# Altium schematic sheet 07_EL_CON.SchDoc
size A4
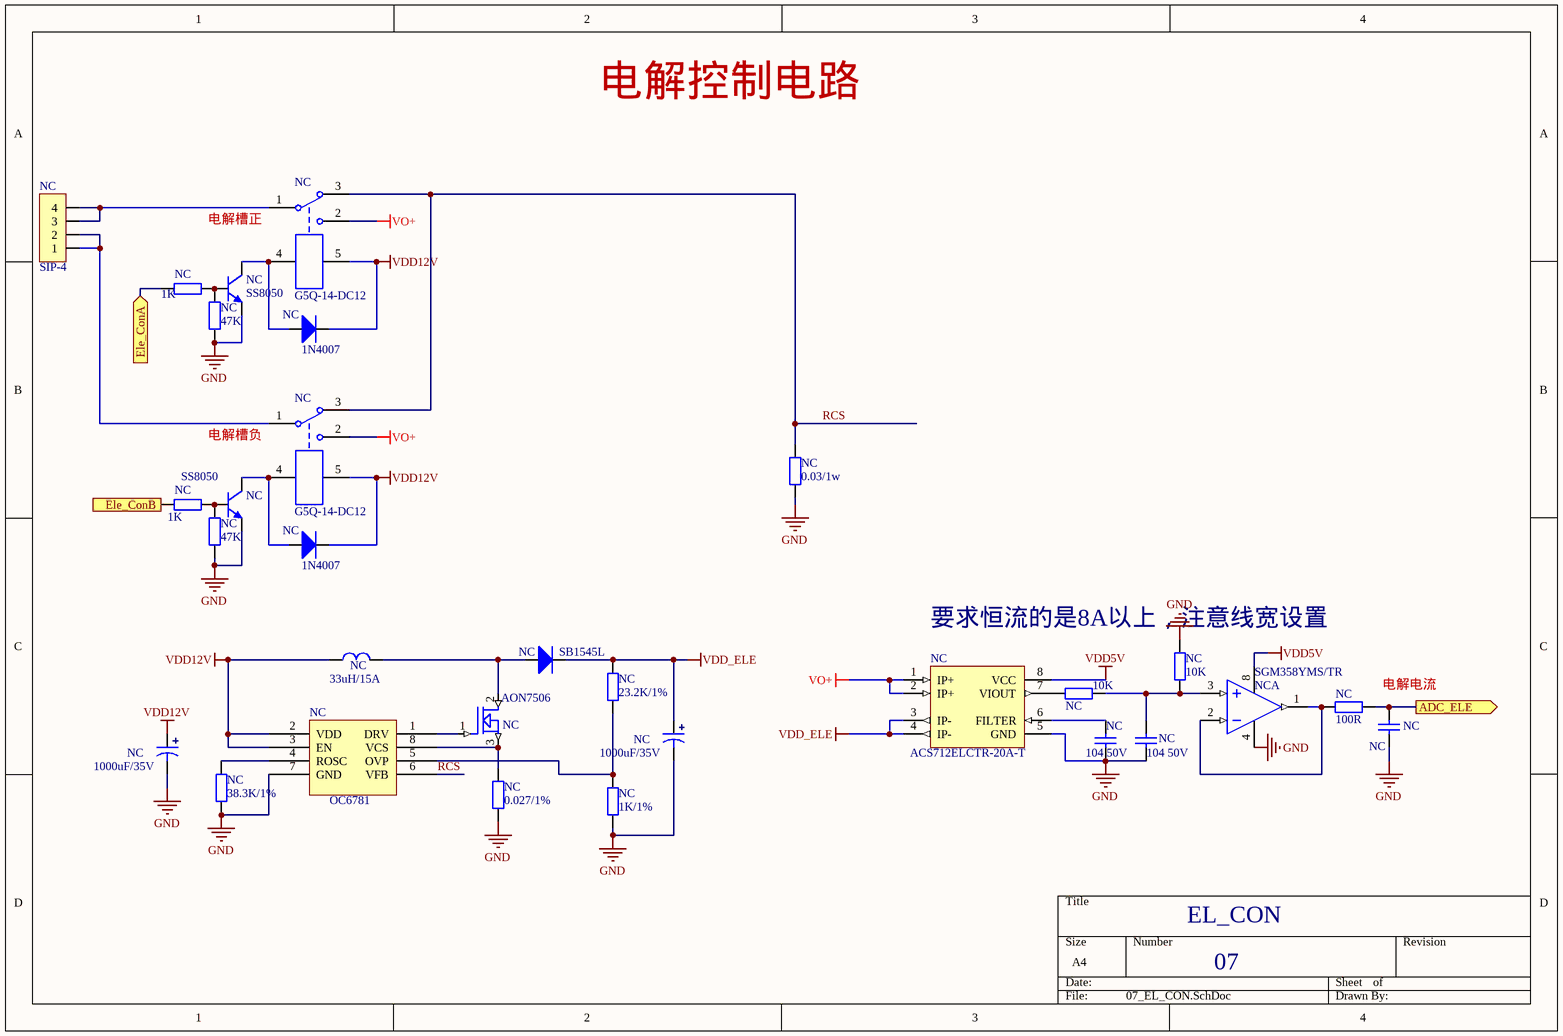
[diagram p0: 07_EL_CON.SchDoc]

## Parts
(Parts that share a designator on the sheet are numbered #1, #2 ... from top to bottom, then left to right.)
NC#1  G5Q-14-DC12  [G5Q-14]
NC#2  SIP-4  [VH-AW-3.96*4P]
NC#3  1K  [SMD-0603]
NC#4  SS8050  [SOT-23]
NC#5  47K  [SMD-0603]
NC#6  1N4007  [DO-214-AC]
NC#7  G5Q-14-DC12  [G5Q-14]
NC#8  0.03/1w  [2512R]
NC#9  1K  [SMD-0603]
NC#10  SS8050  [SOT-23]
NC#11  47K  [SMD-0603]
NC#12  1N4007  [DO-214-AC]
NC#13  33uH/15A  [INDUCTOR_34*18]
NC#14  SB1545L  [TO227]
NC#15  10K  [SMD-0603]
NC#16  23.2K/1%  [SMD-0603]
NC#17  10K  [SMD-0603]
NC#18  SGM358YMS/TR  [MSOP-8]  (part A of 2)
NC#19  100R  [SMD-0603]
NC#20  OC6781  [SOP127P600X265_HS-9N]
NC#21  1000uF/35V  [10*16]
NC#22  104 50V  [SMD-0603C]
NC#23  104 50V  [SMD-0603C]
NC#24  1000uF/35V  [10*16]
NC#25  AON7506  [DFN3*3-8]
NC#26  ACS712ELCTR-20A-T  [SO-8]
NC#27  NC  [SMD-0603C]
NC#28  38.3K/1%  [SMD-0603]
NC#29  0.027/1%  [2512r]
NC#30  1K/1%  [SMD-0603]

## Ports
ADC_ELE (out), Ele_ConA (in), Ele_ConB (in)

## Nets
GND: NC#4.2(E) NC#5.1 NC#8.2 NC#10.2(E) NC#11.1 NC#15.1 NC#18.4(V-) NC#20.7(GND) NC#21.2 NC#22.2 NC#23.2 NC#24.2 NC#26.5(GND) NC#27.1 NC#28.2 NC#29.2 NC#30.2
VDD5V: NC#18.8(V+) NC#26.8(VCC)
VDD12V: NC#1.5 NC#6.2(K) NC#7.5 NC#12.2(K) NC#13.1 NC#20.2(VDD) NC#20.3(EN) NC#24.1
VDD_ELE: NC#14.2(K) NC#16.1 NC#21.1 NC#26.3(IP-) NC#26.4(IP-)
VO+: NC#1.2 NC#7.2 NC#26.1(IP+) NC#26.2(IP+)
ADC_ELE: NC#19.1 NC#27.2 ; port ADC_ELE
Ele_ConA: NC#3.1 ; port Ele_ConA
Ele_ConB: NC#9.1 ; port Ele_ConB
RCS: NC#1.3 NC#7.3 NC#8.1 NC#20.6(VFB)
NetNC#1_1: NC#1.1 NC#2.3 NC#2.4
NetNC#1_4: NC#1.4 NC#4.3(C) NC#6.1(A)
NetNC#2_1: NC#2.1 NC#2.2 NC#7.1
NetNC#3_2: NC#3.2 NC#4.1(B) NC#5.2
NetNC#7_4: NC#7.4 NC#10.3(C) NC#12.1(A)
NetNC#9_2: NC#9.2 NC#10.1(B) NC#11.2
NetNC#13_2: NC#13.2 NC#14.1(A) NC#25.2(D)
NetNC#15_2: NC#15.2 NC#17.1 NC#18.3(IN1+) NC#23.1
NetNC#16_2: NC#16.2 NC#20.5(OVP) NC#30.1
NetNC#17_2: NC#17.2 NC#26.7(VIOUT)
NetNC#18_1: NC#18.1(OUT1) NC#18.2(IN1-) NC#19.2
NetNC#20_1: NC#20.1(DRV) NC#25.1(G)
NetNC#20_4: NC#20.4(ROSC) NC#28.1
NetNC#20_8: NC#20.8(VCS) NC#25.3(S) NC#29.1
NetNC#22_1: NC#22.1 NC#26.6(FILTER)

## Notes on the sheet
- 电解控制电路
- (near NC#4) 电解槽正
- (near NC#10) 电解槽负
- (near NC#26) 要求恒流的是8A以上，注意线宽设置
- (near NC#19) 电解电流
- EL_CON
- 07

## Library data of the parts
NC#1 NC#7 = JDQ1: 5V 继电器
NC#2 = SIP-4: 3.96 4P 直插
NC#3 NC#5 NC#9 NC#11 = RES2: 贴片电阻 5%
NC#4 NC#10 = NPN-1: 三极管
NC#6 NC#12 = DIODE2: 贴片二极管
NC#8 NC#16 NC#28-NC#30 = R: 贴片电阻 5%
NC#13 = Inductor1: 10uH 1A
NC#14 = DIODE2: 肖特基二极管
NC#15 NC#17 = RES0: 贴片电阻 1%
NC#18 = LM358: 运算放大器
NC#19 = RES0: 贴片电阻 5%
NC#21 NC#24 = CAP2: 电解电容
NC#22 = C: 贴片电容 10%
NC#23 NC#27 = CAP4: 贴片电容 10%
NC#25 = MOSFET N
NC#26 = ACS712: HALL 20A 电流传感器